# Altium project Game_Consol.PrjPCB
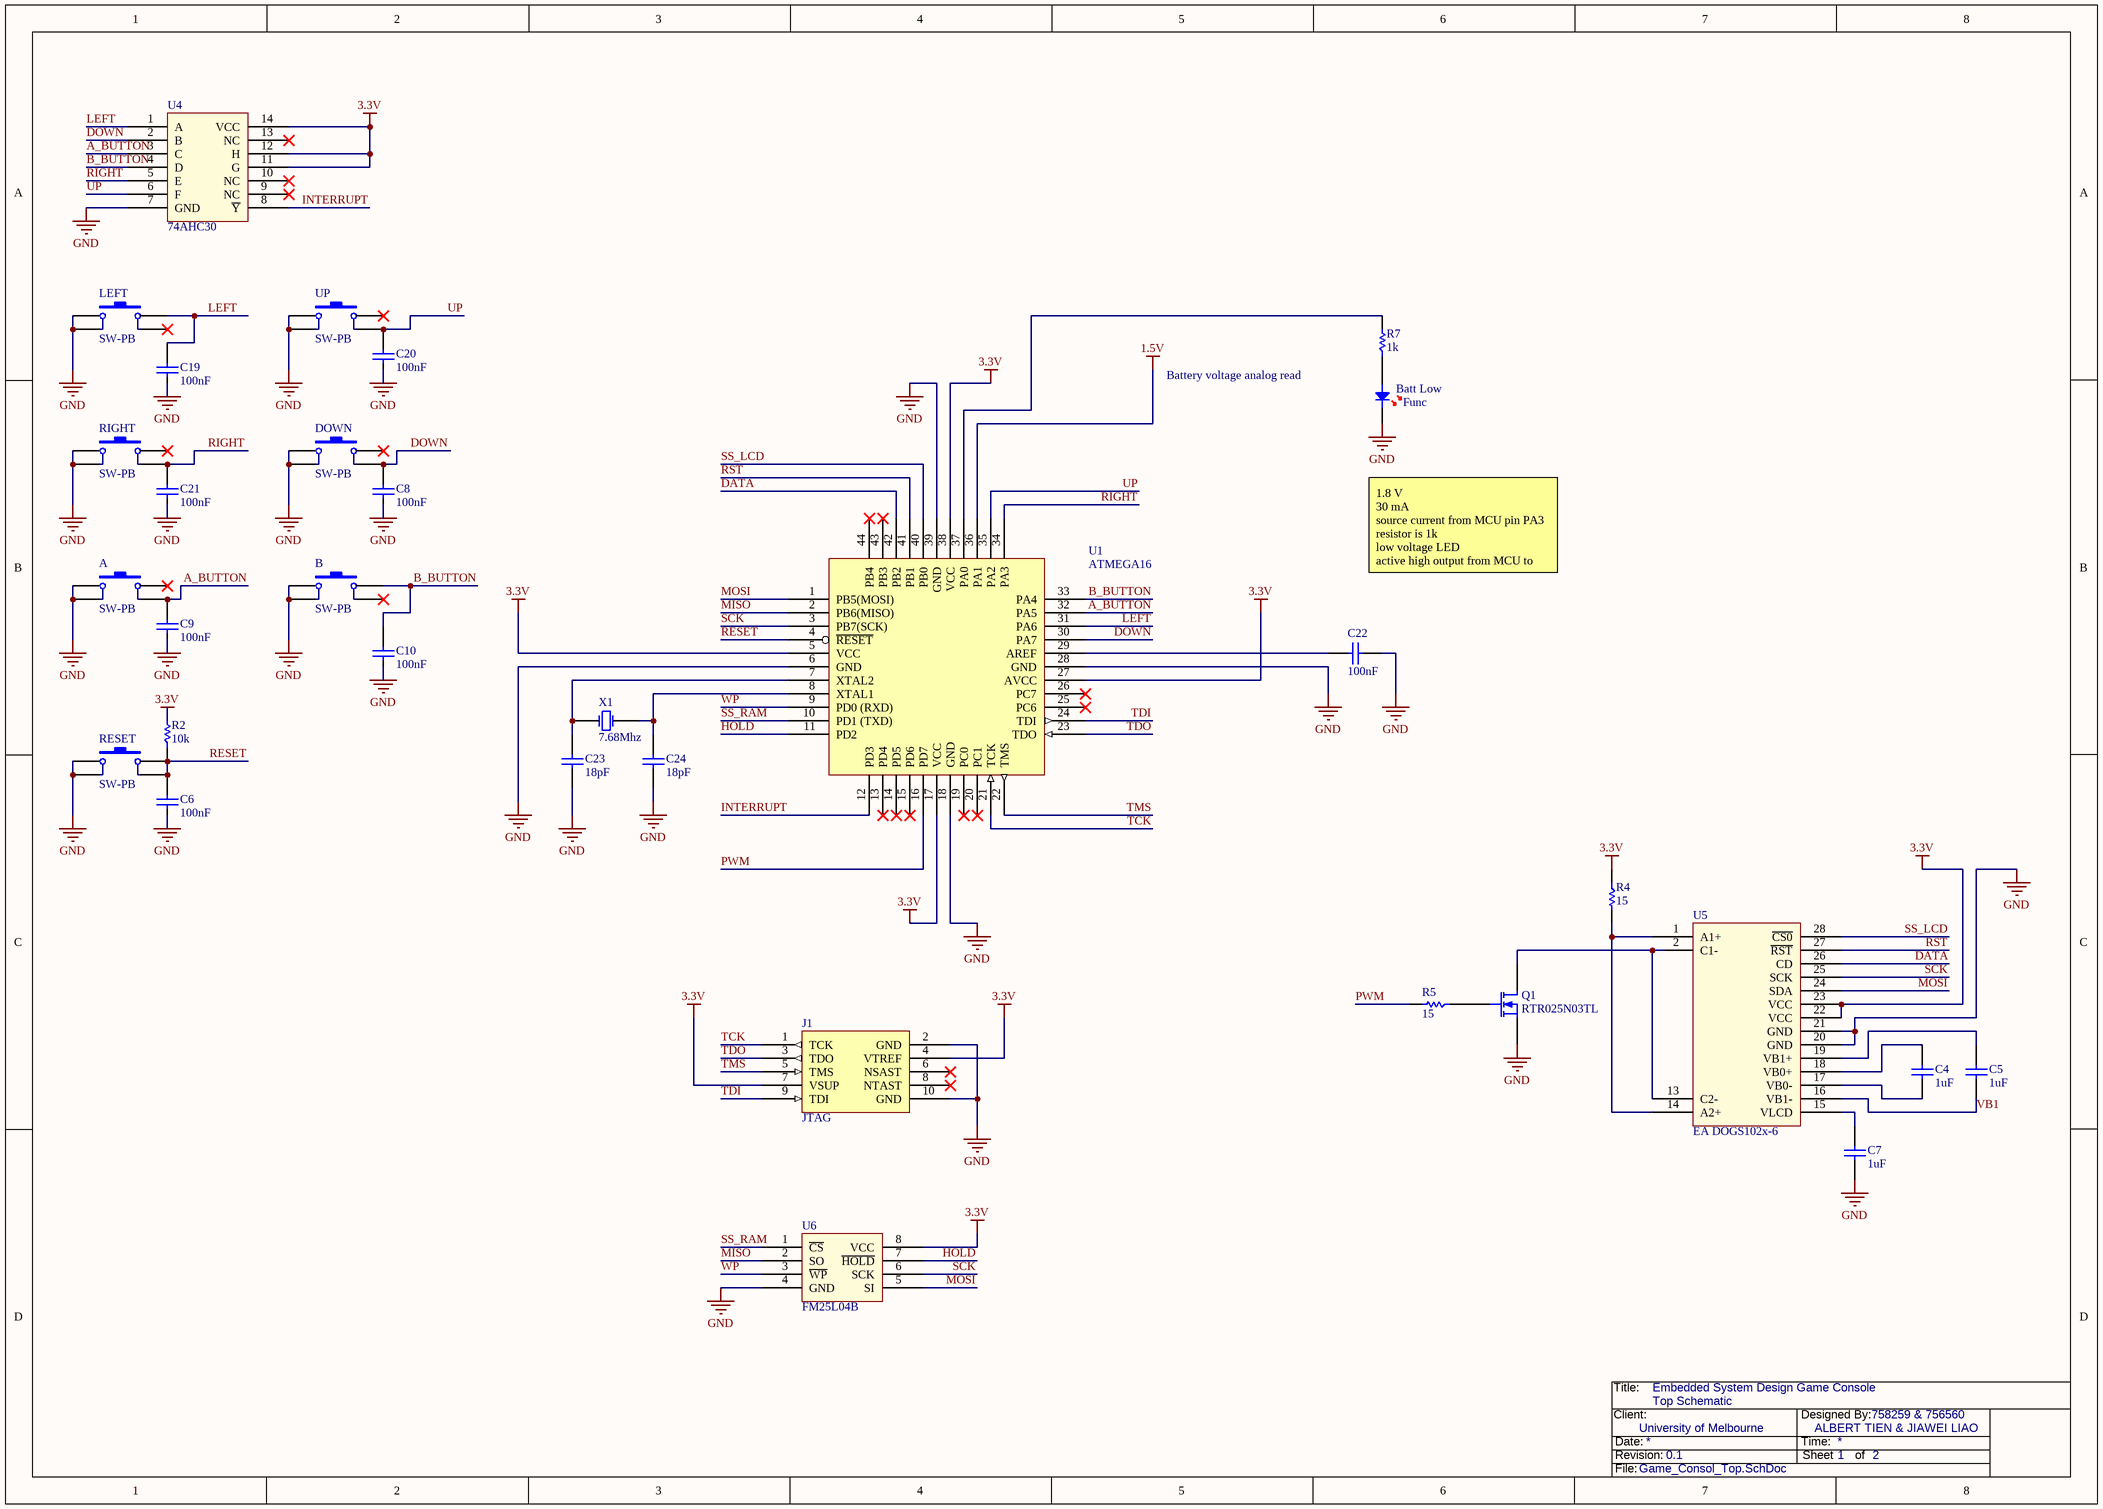
[diagram p0: Game_Consol_Top.SchDoc]

2 sheets, 54 parts. Net scope: global (net labels, ports and power ports of the same name join across sheets).
Board file: Game_Consol_756560.PcbDoc
Sheets:
  Game_Consol_Top.SchDoc
  Game_Consol_Power.SchDoc

## Sheet Game_Consol_Top.SchDoc: Schematic_Name
size A3; CompanyName: University of Melbourne; DrawnBy: Student_#; Engineer: Your Name Here; Organization: University of Melbourne; DocumentNumber: 1; Revision: 0.1; SheetNumber: 1; SheetTotal: 10; Title_Project: Project_Title

### Parts
A  SW-PB  [SPNO_SMD]
B  SW-PB  [SPNO_SMD]
Batt_Low  Func  [0805D]
C4  1uF  [0805]
C5  1uF  [0805]
C6  100nF  [0805]
C7  1uF  [0805]
C8  100nF  [0805]
C9  100nF  [0805]
C10  100nF  [0805]
C19  100nF  [0805]
C20  100nF  [0805]
C21  100nF  [0805]
C22  100nF  [0805]
C23  (no value)  [0805]
C24  18pF  [0805]
DOWN  SW-PB  [SPNO_SMD]
J1  JTAG  [BOXEDVERT10]
LEFT  SW-PB  [SPNO_SMD]
Q1  RTR025N03TL  [SOT23]
R2  10k  [0805]
R4  15  [0805]
R5  15  [0805]
R7  1k  [0805]
RESET  SW-PB  [SPNO_SMD]
RIGHT  SW-PB  [SPNO_SMD]
U1  ATMEGA16  [QFP-48]
U4  74AHC30  [SOIC-14]
U5  EA DOGS102x-6  [EA DOGS102x]
U6  FM25L04B  [SOIC-8]
UP  SW-PB  [SPNO_SMD]
X1  7.68Mhz  [XTAL_FLAT_SMD]

### Nets
1.5V: U1.36(PA1)
3.3V: J1.4(VTREF) J1.7(VSUP) R2.2 R4.1 U1.5(VCC) U1.17(VCC) U1.27(AVCC) U1.38(VCC) U4.11(G) U4.12(H) U4.14(VCC) U5.22(VCC) U5.23(VCC) U6.8(VCC)
GND: A.1 A.2 B.1 B.2 Batt_Low.K C6.2 C7.2 C8.2 C9.2 C10.2 C19.2 C20.2 C21.2 C22.1 C23.2 C24.2 DOWN.1 DOWN.2 J1.2(GND) J1.10(GND) LEFT.1 LEFT.2 Q1.2 RESET.1 RESET.2 RIGHT.1 RIGHT.2 U1.6(GND) U1.18(GND) U1.28(GND) U1.39(GND) U4.7(GND) U5.20(GND) U5.21(GND) U6.4(GND) UP.1 UP.2
A_BUTTON: A.4 C9.1 U1.32(PA5) U4.3(C)
B_BUTTON: B.3 C10.1 U1.33(PA4) U4.4(D)
DATA: U1.42(PB2) U5.26(CD)
DOWN: C8.1 DOWN.4 U1.30(PA7) U4.2(B)
HOLD: U1.11(PD2) U6.7(~{HOLD})
INTERRUPT: U1.12(PD3) U4.8(~{Y})
LEFT: C19.1 LEFT.3 U1.31(PA6) U4.1(A)
MISO: U1.2(PB6(MISO)) U6.2(SO)
MOSI: U1.1(PB5(MOSI)) U5.24(SDA) U6.5(SI)
PWM: R5.2 U1.16(PD7)
RESET: C6.1 R2.1 RESET.3 RESET.4 U1.4(~{RESET})
RIGHT: C21.1 RIGHT.4 U1.34(PA3) U4.5(E)
RST: U1.41(PB1) U5.27(~{RST})
SCK: U1.3(PB7(SCK)) U5.25(SCK) U6.6(SCK)
SS_LCD: U1.40(PB0) U5.28(~{CS0})
SS_RAM: U1.10(PD1_(TXD)) U6.1(~{CS})
TCK: J1.1(TCK) U1.21(TCK)
TDI: J1.9(TDI) U1.24(TDI)
TDO: J1.3(TDO) U1.23(TDO)
TMS: J1.5(TMS) U1.22(TMS)
UP: C20.1 U1.35(PA2) U4.6(F) UP.4
VB1: C5.2 U5.16(VB1-)
WP: U1.9(PD0_(RXD)) U6.3(~{WP})
NetBatt_Low_A: Batt_Low.A R7.1
NetC4_1: C4.1 U5.18(VB0+)
NetC4_2: C4.2 U5.17(VB0-)
NetC5_1: C5.1 U5.19(VB1+)
NetC7_1: C7.1 U5.15(VLCD)
NetC22_2: C22.2 U1.29(AREF)
NetC23_1: C23.1 U1.7(XTAL2) X1.2(OSC2)
NetC24_1: C24.1 U1.8(XTAL1) X1.1(OSC1)
NetQ1_1: Q1.1 R5.1
NetQ1_3: Q1.3 U5.2(C1-) U5.13(C2-)
NetR4_2: R4.2 U5.1(A1+) U5.14(A2+)
NetR7_2: R7.2 U1.37(PA0)

Not connected (* = marked no-connect by the designer): A 3*; B 4*; DOWN 3*; J1 6(NSAST)* 8(NTAST)*; LEFT 4*; RIGHT 3*; U1 13(PD4)* 14(PD5)* 15(PD6)* 19(PC0)* 20(PC1)* 25(PC6)* 26(PC7)* 43(PB3)* 44(PB4)*; U4 9(NC)* 10(NC)* 13(NC)*; U5 3 4 5 6 7 8 9 10 11 12; UP 3*

### Notes on the sheet
- (near U4) UP, DOWN, LEFT, RIGHT, A, B, C, RESET buttons: active low
  internal pull up resistor
  RESET button has external pull up resistor incase the MCU internal resistor fails
- (near LEFT) BUTTON LEFT
- (near UP) BUTTON DOWN
- Battery voltage analog read
- (near RIGHT) BUTTON RIGHT
- (near DOWN) BUTTON DOWN
- 1.8 V
  30 mA
  source current from MCU pin PA3
  resistor is 1k
  low voltage LED
  active high output from MCU to turn on
- (near A) BUTTON ACTION
- (near B) BUTTON BACK
- (near RESET) BUTTON RESET
- Title:
- Embedded System Design Game Console
- Client:
- Date:
- Revision:
- Top Schematic
- Time:
- Designed By:
- Sheet
- ALBERT TIEN & JIAWEI LIAO
- of
- 758259 & 756560
- 2
- File:
- (in symbol C 0805) 18pF

### Library data of the parts
A B DOWN LEFT RESET RIGHT UP = SW-PB: Push Button Switch; Manufacturer: TE Connectivity; Manufacturer Part Number: FSM4JSMA; Circuit: SPST-NO; Switch Function: Off-Mom; Contact Rating @ Voltage: 0.05A @ 12VDC; Actuator Type: Standard; Actuator Orientation: Top Actuated; Outline: 6.00mm x 6.00mm; Illumination: Non-Illuminated; Operating Force: 160gf; Published: 24-Mar-1999; LatestRevisionDate: 17-Jul-2002; LatestRevisionNote: Re-released for DXP Platform.; PackageReference: SPST-2; Publisher: Altium Limited; PackageDescription: Switch; 2 Leads; Supplier 1: Digi-Key; RoHS: RoHS Compliant; Category: Switches; Stock 1: 30338; Pricing 1: 1=0.28, 10=0.265, 25=0.2256, 50=0.1974, 100=0.1834, 250=0.1622, 500=0.15516, 1000=0.12694, 5000=0.10579 (AUD); Mounting Type: Surface Mount; Termination Style: Gull Wing; Packaging: Bulk; ComponentLink1URL: http://documents.tycoelectronics.com/commerce/DocumentDelivery/DDEController?Action=srchrtrv&DocNm=2-1437565-7&DocType=CD&DocLang=EN; ComponentLink1Description: http://documents.tycoelectronics.com/commerce/DocumentDelivery/DDEController?Action=srchrtrv&DocNm=2-1437565-7&DocType=CD&DocLang=EN; Supplier Part Number 1: 450-1129-ND
Batt_Low = LED RED: Light Emitting Diode; Manufacturer: Generic Components; Class I: Discrete; Class II: Diode - Switching; Published: 8-Jun-2000; Revision: July-2002: Re-released for DXP Platform.; Publisher: Altium Limited
C4-C10 C19-C24 = C 0805: Capacitor 100nF; Class I: Passive; Revision: July-2002: Re-released for DXP Platform.
  C4 C5 C7: Value: 1uF
  C6 C8-C10 C19-C22: Value: 100nF
  C24: Value: 18pF
J1 = JTAG_CON: JTAG ATMEL connector
Q1 = MOSFET-N: N-Channel MOSFET; PackageDocument: 1995/1996; Published: 8-Jun-2000; LatestRevisionDate: 17-Jul-2002; LatestRevisionNote: Re-released for DXP Platform.; PackageReference: E3; Publisher: Altium Limited
R2 R4 R5 R7 = R: Resistor
  R2: Value: 10k
  R4 R5: Value: 15
  R7: Value: 1k
U1 = ATMEGA16: ATMEGA16 Microcontroller
U4 = 74AHC30: 1 x 8 Input NAND gate
U5 = EA DOGS102x-6: LCD 102x64-pixel with backlight
U6 = FM25L04B: FRAM 4Kb Memory
X1 = XTAL: Crystal Oscillator; Revision: July-2002: Re-released for DXP Platform.; Digikey: 535-9103-1-ND

## Sheet Game_Consol_Power.SchDoc: Schematic_Name
size A4; CompanyName: University of Melbourne; DrawnBy: Student_#; Engineer: Albert & David; Organization: University of Melbourne; DocumentNumber: 1; Revision: 0.1; SheetNumber: 1; SheetTotal: 10; Title_Project: Project_Title
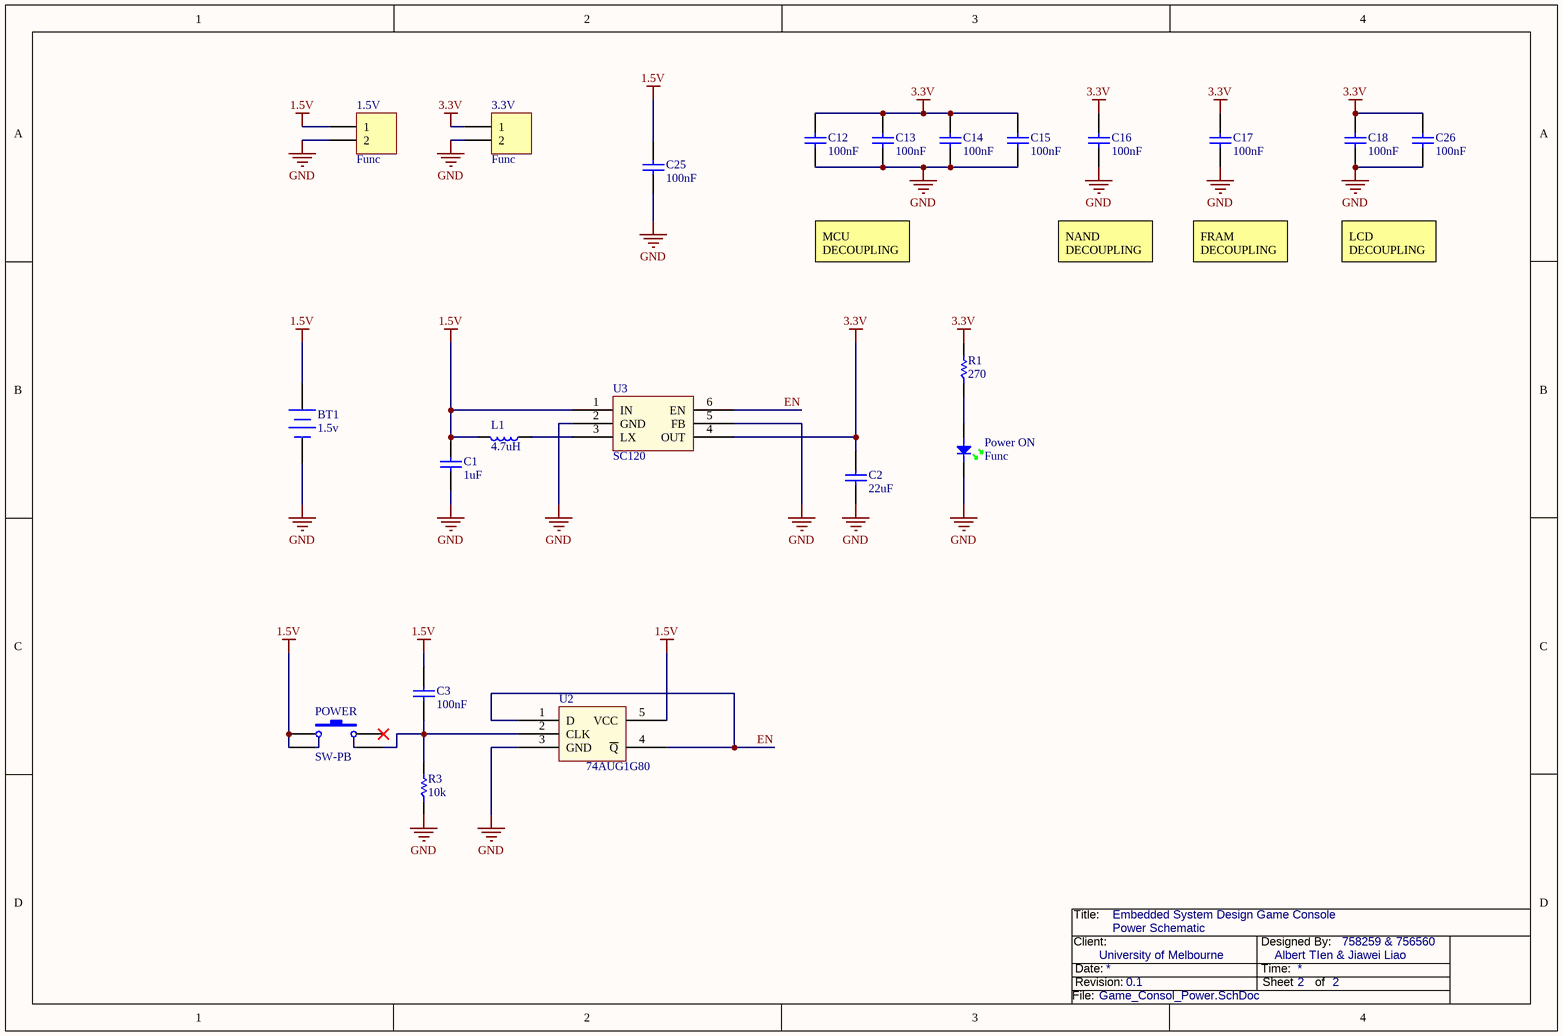
[diagram p1: Game_Consol_Power.SchDoc]

### Parts
1.5V  Func  [HDR1X2]
3.3V  Func  [HDR1X2]
BT1  1.5v  [BATT_HOLDER]
C1  1uF  [0805]
C2  22uF  [1210]
C3  100nF  [0805]
C12  100nF  [0805]
C13  100nF  [0805]
C14  100nF  [0805]
C15  100nF  [0805]
C16  100nF  [0805]
C17  100nF  [0805]
C18  100nF  [0805]
C25  100nF  [0805]
C26  100nF  [0805]
L1  4.7uH  [1210L]
POWER  SW-PB  [SPNO_SMD]
Power_ON  Func  [0805D]
R1  270  [0805]
R3  10k  [0805]
U2  74AUG1G80  [SOT23-5]
U3  SC120  [SOT23-6]

### Nets
1.5V: 1.5V.1 BT1.1(+) C1.1 C3.1 C25.1 L1.2 POWER.1 POWER.2 U2.5(VCC) U3.1(IN)
3.3V: 3.3V.1 C2.1 C12.1 C13.1 C14.1 C15.1 C16.1 C17.1 C18.1 C26.1 R1.2 U3.4(OUT)
GND: 1.5V.2 3.3V.2 BT1.2(-) C1.2 C2.2 C12.2 C13.2 C14.2 C15.2 C16.2 C17.2 C18.2 C25.2 C26.2 Power_ON.K R3.1 U2.3(GND) U3.2(GND) U3.5(FB)
EN: U2.1(D) U2.4(~{Q}) U3.6(EN)
NetC3_2: C3.2 POWER.4 R3.2 U2.2(CLK)
NetL1_1: L1.1 U3.3(LX)
NetPower_ON_A: Power_ON.A R1.1

Not connected (* = marked no-connect by the designer): POWER 3*

### Notes on the sheet
- MCU DECOUPLING
- NAND
  DECOUPLING
- FRAM
  DECOUPLING
- LCD DECOUPLING
- Title:
- Embedded System Design Game Console
- Client:
- Date:
- Revision:
- Power Schematic
- Time:
- Designed By:
- Sheet
- Albert TIen & Jiawei Liao
- 2
- of
- 758259 & 756560
- File:

### Library data of the parts
1.5V 3.3V = HDR2: 2 Pin Header; LatestRevisionDate: 17-Jul-2002; LatestRevisionNote: Re-released for DXP Platform.; Publisher: Altium Limited
BT1 = BAT: Battery Holder AA 1.5v; Published: 24-Mar-1999; LatestRevisionDate: 17-Jul-2002; LatestRevisionNote: Re-released for DXP Platform.; PackageReference: BAT-2; Publisher: Altium Limited; PackageDescription: Battery; 2 Leads
C1 C3 C12-C18 C25 C26 = C 0805: Capacitor 100nF; Class I: Passive; Revision: July-2002: Re-released for DXP Platform.
  C1: Value: 1uF
  C3 C12-C18 C25 C26: Value: 100nF
C2 = C 1210: Capacitor 22uF; Manufacturer: Generic Components; Manufacturer Part Number: LMK316F226ZL-T; Class I: Passive; Capacitance: 22礔; Voltage - Rated: 10V; Tolerance: -20%, +80%; Temperature Coefficient: Y5V (F); Published: 8-Jun-2000; Revision: July-2002: Re-released for DXP Platform.; Publisher: Altium Limited; Class II: Capacitor; Supplier 1: Digi-Key; RoHS: RoHS Compliant; Category: Capacitors; Stock 1: 33004; Pricing 1: 1=0.3, 10=0.254, 50=0.143, 100=0.1271, 250=0.09532, 500=0.08418, 1000=0.07465 (AUD); Mounting Type: Surface Mount, MLCC; Operating Temperature: -30癈 ~ 85癈; Applications: General Purpose; Ratings: -; Package / Case: 1206 (3216 Metric); Size / Dimension: 0.126" L x 0.063" W (3.20mm x 1.60mm); Height - Seated (Max): -; Thickness (Max): 0.071" (1.80mm); Lead Spacing: -; Features: -; Packaging: Cut Tape (CT); Lead Style: -; ComponentLink1URL: http://www.yuden.co.jp/or/product/category/capacitor/LMK316F226ZL-T.pdf; ComponentLink1Description: http://www.yuden.co.jp/or/product/category/capacitor/LMK316F226ZL-T.pdf; Supplier Part Number 1: 587-1356-1-ND; Value: 22uF
L1 = I 1210: Inductor 4.7uH; Manufacturer: Murata Electronics North America; Manufacturer Part Number: LQH32CN4R7M23L; Code_IEC: 1005; Inductance: 4.7礖; Current: 450mA; Type: Ferrite Core; Tolerance: ?0%; Shielding: Unshielded; DC Resistance (DCR): 260 mOhm Max; Frequency - Self Resonant: 43MHz; Material - Core: Ferrite; Frequency - Test: 1MHz; Published: 8-Jun-2000; LatestRevisionDate: 17-Jul-2002; LatestRevisionNote: Re-released for DXP Platform.; PackageReference: 0402-A; Publisher: Altium Limited; Code_JEITA: 0402; Class II: Inductor; Supplier 1: Digi-Key; RoHS: RoHS Compliant; Category: Inductors, Coils, Chokes; Stock 1: 31057; Pricing 1: 1=0.34, 10=0.313, 25=0.2784, 50=0.2436, 100=0.2261, 250=0.20868, 500=0.19824, 750=0.18084, 1000=0.15998 (AUD); Current - Saturation: -; Current - Temperature Rise: -; Q @ Freq: -; Applications: Power Supplies; Package / Case: 1210 (3225 Metric); Mounting Type: Surface Mount; Packaging: Cut Tape (CT); Operating Temperature: -40癈 ~ 85癈; ComponentLink1URL: http://search.murata.co.jp/Ceramy/image/img/PDF/ENG/L0075S0093LQH32C_23~33.pdf; ComponentLink1Description: http://search.murata.co.jp/Ceramy/image/img/PDF/ENG/L0075S0093LQH32C_23~33.pdf; Supplier Part Number 1: 490-2495-1-ND; Value: 4.7uH
POWER = SW-PB: as A on sheet Game_Consol_Top; Published: 24-Mar-1999; LatestRevisionDate: 17-Jul-2002; LatestRevisionNote: Re-released for DXP Platform.; PackageReference: SPST-2; Publisher: Altium Limited; PackageDescription: Switch; 2 Leads; Supplier 1: Digi-Key; RoHS: RoHS Compliant; Category: Switches; Stock 1: 30338; Pricing 1: 1=0.28, 10=0.265, 25=0.2256, 50=0.1974, 100=0.1834, 250=0.1622, 500=0.15516, 1000=0.12694, 5000=0.10579 (AUD); Mounting Type: Surface Mount; Termination Style: Gull Wing; Packaging: Bulk; ComponentLink1URL: http://documents.tycoelectronics.com/commerce/DocumentDelivery/DDEController?Action=srchrtrv&DocNm=2-1437565-7&DocType=CD&DocLang=EN; ComponentLink1Description: http://documents.tycoelectronics.com/commerce/DocumentDelivery/DDEController?Action=srchrtrv&DocNm=2-1437565-7&DocType=CD&DocLang=EN; Supplier Part Number 1: 450-1129-ND
Power_ON = LED GREEN: Light Emitting Diode; Manufacturer: Generic Components; Class I: Discrete; Class II: Diode - Switching; Published: 8-Jun-2000; Revision: July-2002: Re-released for DXP Platform.; Publisher: Altium Limited
R1 R3 = R: Resistor
  R1: Value: 270
  R3: Value: 10k
U2 = 74AUG1G80: Inverted single D flip flop
U3 = SC120: Regulator Low Voltage

## Nets that join several sheets
1.5V: Game_Consol_Top (U1.36), Game_Consol_Power (10 pins)
3.3V: Game_Consol_Top (14 pins), Game_Consol_Power (12 pins)
GND: Game_Consol_Top (37 pins), Game_Consol_Power (19 pins)